# EAGLE schematic TRV_MRF49_V1.2 (EAGLE 6.3)
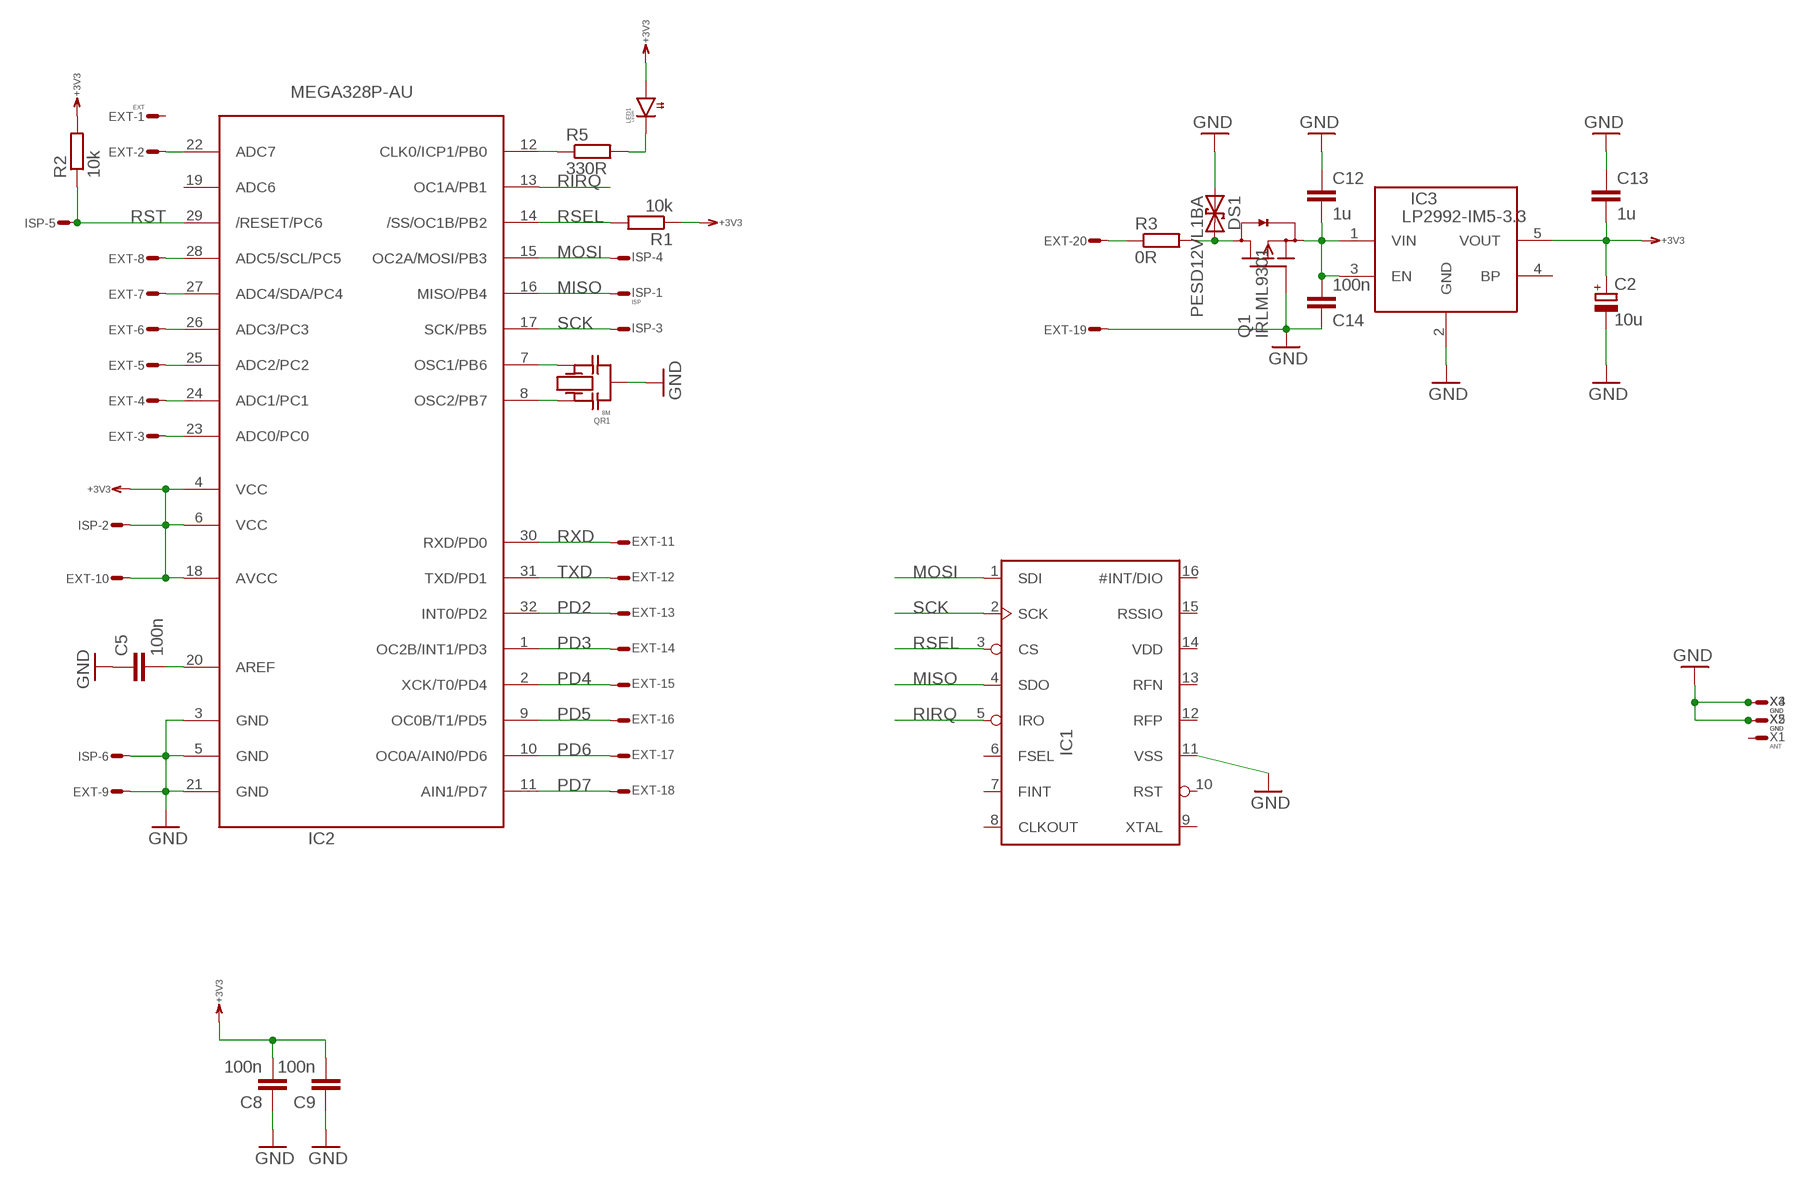
[diagram p0: schematic, sheet 1]

## Parts
C2  10u  C_POLSMCB  [SMC_B]
C5  100n  C0603  [0603]
C8  100n  C0603  [0603]
C9  100n  C0603  [0603]
C12  1u  C0603  [0603]
C13  1u  C0603  [0603]
C14  100n  C0603  [0603]
DS1  PESD12VL1BA  TVS-U323  [SOD323]
EXT  EXT  ML20SE  [ML20S]
IC1  MRF49XA  [TSSOP16]
IC2  MEGA328P-AU  MEGA168PA  [TQFP32-08]
IC3  LP2992-IM5-3.3  LDO  [SOT23-5]
ISP  ISP  ML6ES  [ML6S]
LED1  LEDR  LED0805  [0805]
Q1  IRLML9301  FET-PDSOT23  [SOT23]
QR1  8M  QRCR  [CR]
R1  10k  R0603  [0603]
R2  10k  R0603  [0603]
R3  0R  R0603  [0603]
R5  330R  R0603  [0603]
X1  ANT  WIREPADS2.54/1.27  [S2.54/1.27]
X2  GND  WIREPADS2.54/1.27  [S2.54/1.27]
X3  GND  WIREPADS2.54/1.27  [S2.54/1.27]
X4  GND  WIREPADS2.54/1.27  [S2.54/1.27]
X5  GND  WIREPADS2.54/1.27  [S2.54/1.27]

## Nets
+3V3: C2.+ C8.2 C9.2 C13.2 EXT.10 IC2.4(VCC) IC2.6(VCC) IC2.18(AVCC) IC3.5(VOUT) ISP.2 LED1.C(A) R1.1 R2.2
GND: C2.- C5.1 C8.1 C9.1 C12.1 C13.1 C14.1 DS1.A EXT.9 EXT.19 IC1.11(VSS) IC2.3(GND) IC2.5(GND) IC2.21(GND) IC3.2(GND) ISP.6 Q1.1(G) QR1.M X2.1(S) X3.1(S) X4.1(S) X5.1(S)
MISO: IC1.4(SDO) IC2.16(MISO/PB4) ISP.1
MOSI: IC1.1(SDI) IC2.15(OC2A/MOSI/PB3) ISP.4
N$3: EXT.2 IC2.22(ADC7)
N$5: DS1.C Q1.3(D) R3.2
N$6: C5.2 IC2.20(AREF)
N$7: IC2.8(OSC2/PB7) QR1.1
N$8: IC2.7(OSC1/PB6) QR1.2
N$9: EXT.20 R3.1
N$10: IC2.12(CLK0/ICP1/PB0) R5.1
N$12: C12.2 C14.2 IC3.1(VIN) IC3.3(EN) Q1.2(S)
N$21: LED1.A(C) R5.2
PC0: EXT.3 IC2.23(ADC0/PC0)
PC1: EXT.4 IC2.24(ADC1/PC1)
PC2: EXT.5 IC2.25(ADC2/PC2)
PC3: EXT.6 IC2.26(ADC3/PC3)
PC4: EXT.7 IC2.27(ADC4/SDA/PC4)
PC5: EXT.8 IC2.28(ADC5/SCL/PC5)
PD2: EXT.13 IC2.32(INT0/PD2)
PD3: EXT.14 IC2.1(OC2B/INT1/PD3)
PD4: EXT.15 IC2.2(XCK/T0/PD4)
PD5: EXT.16 IC2.9(OC0B/T1/PD5)
PD6: EXT.17 IC2.10(OC0A/AIN0/PD6)
PD7: EXT.18 IC2.11(AIN1/PD7)
RIRQ: IC1.5(IRO) IC2.13(OC1A/PB1)
RSEL: IC1.3(CS) IC2.14(/SS/OC1B/PB2) R1.2
RST: IC2.29(/RESET/PC6) ISP.5 R2.1
RXD: EXT.11 IC2.30(RXD/PD0)
SCK: IC1.2(SCK) IC2.17(SCK/PB5) ISP.3
TXD: EXT.12 IC2.31(TXD/PD1)
Unconnected: EXT.1 IC1.6(FSEL) IC1.7(FINT) IC1.8(CLKOUT) IC1.9(XTAL) IC1.10(RST) IC1.12(RFP) IC1.13(RFN) IC1.14(VDD) IC1.15(RSSIO) IC1.16(#INT/DIO) IC2.19(ADC6) IC3.4(BP) X1.1(S)

## Library data of the parts
C2 = RCL:C_POL: POLARIZED CAPACITOR, European symbol
C5 C8 C9 C12-C14 = RCL:C: Capacitor SMD
DS1 = Diode:TVS-U: DIODE
EXT = Conn:ML20?E: HARTING
IC1 = RF:MRF49XA
IC2 = atmel:MEGA168P: MCU, 4/8/16k, TQFP32
IC3 = DCDC:LDO
ISP = Conn:ML6E: HARTING
LED1 = Optic:LED
Q1 = Transistor:FET-PD
QR1 = QUARTZ:QR
R1-R3 R5 = RCL:R: Resistor SMD
X1-X5 = Conn:WIREPAD: Wire PAD connect wire on PCB